# EAGLE design magnet-motor-encoder_v1 (EAGLE 6.6.0)
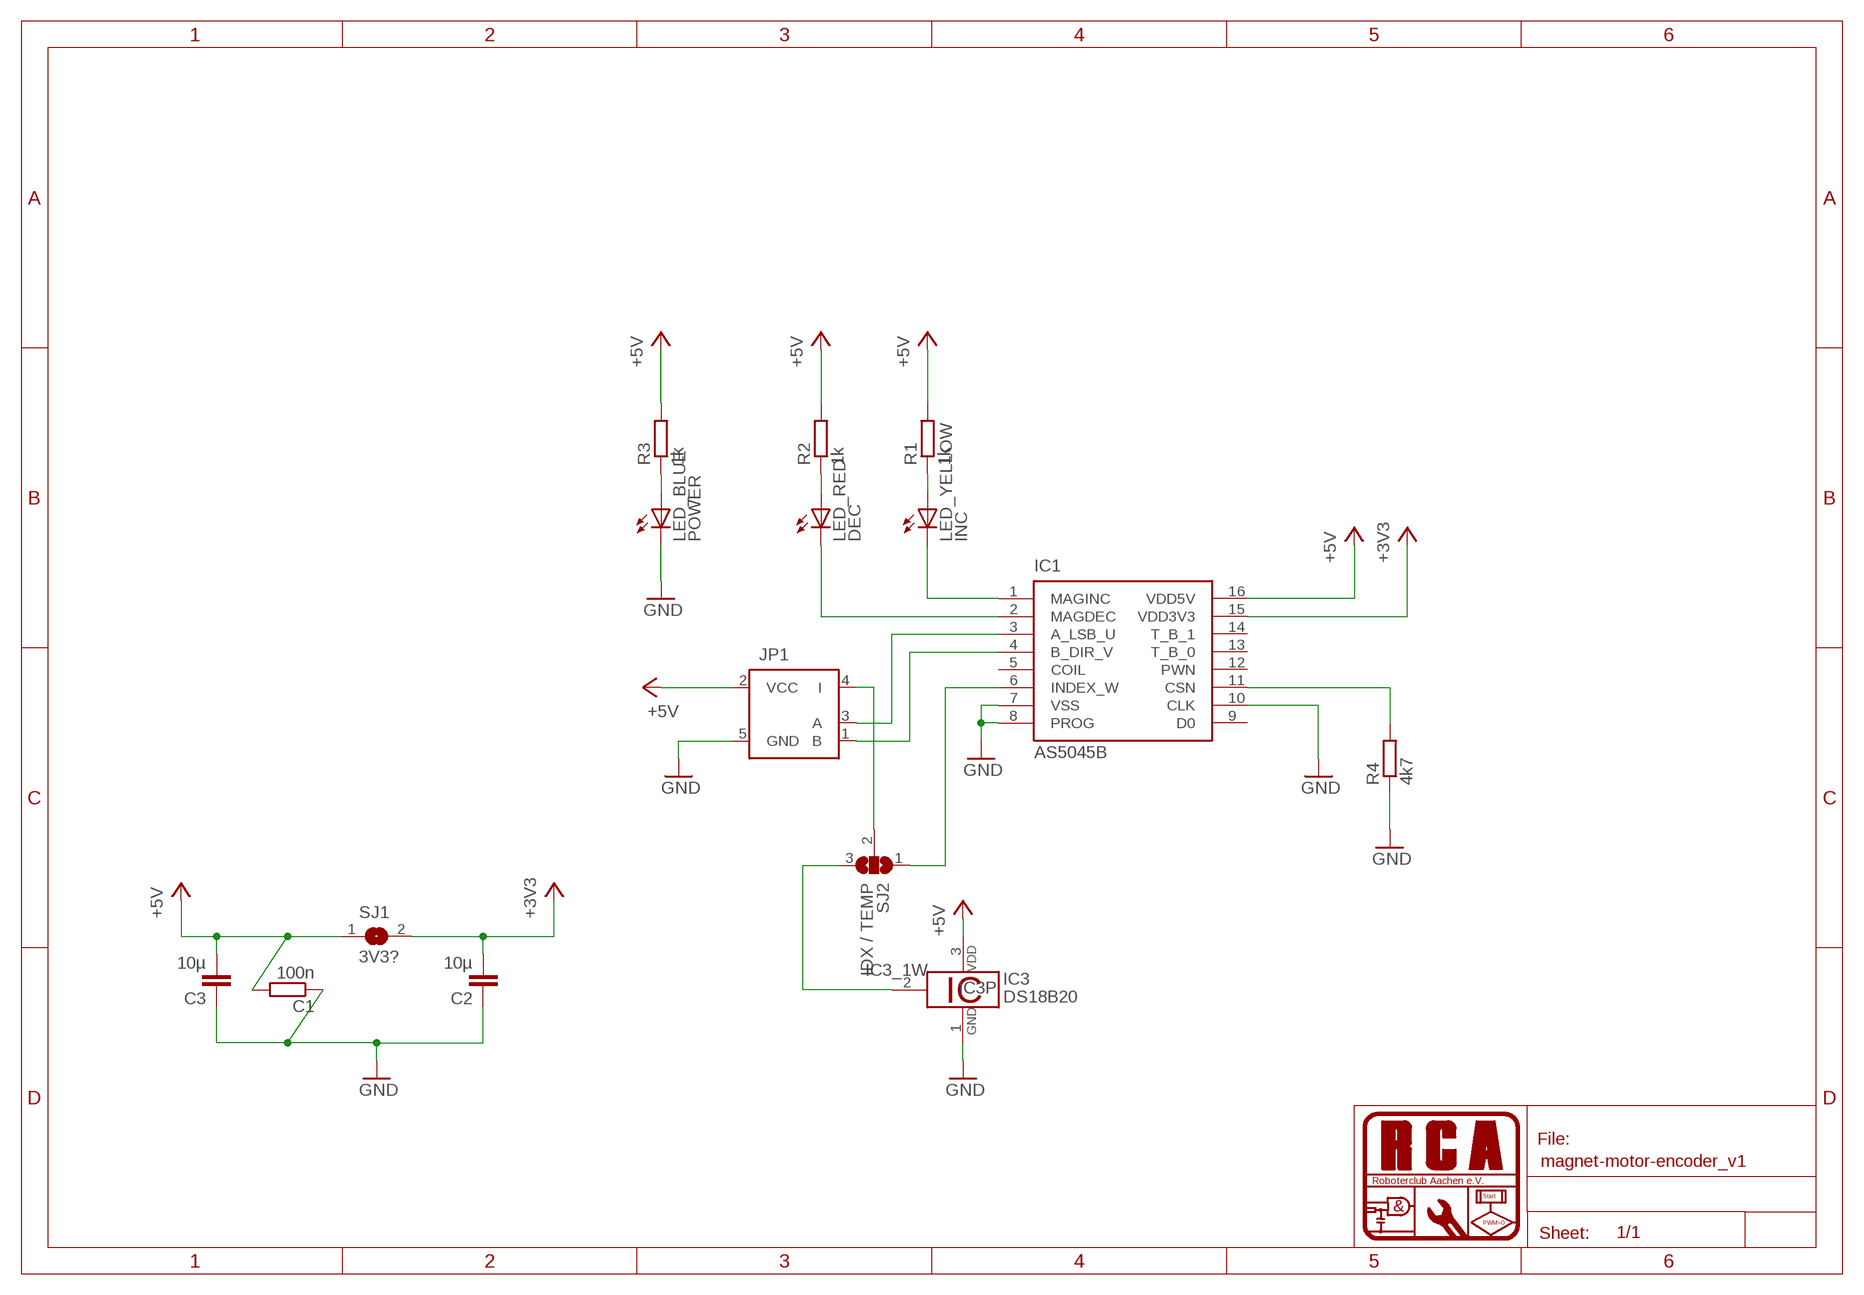
[diagram p0: schematic, sheet 1]

## Parts
C1  100n  R-EU_R0603  [R0603]
C2  10µ  C-EUC0805K  [C0805K]
C3  10µ  C-EUC0805K  [C0805K]
IC1  AS5045B  AS5040  [SSOP16]
IC3  DS18B20  DS18S20  [TO92-]
JP1  ENCODERPSS  [22-23-2051]
LED_BLUE  POWER  LEDCHIPLED_0805  [CHIPLED_0805]
LED_RED  DEC  LEDCHIPLED_0805  [CHIPLED_0805]
LED_YELLOW  INC  LEDCHIPLED_0805  [CHIPLED_0805]
R1  1k  R-EU_R0805  [R0805]
R2  1k  R-EU_R0805  [R0805]
R3  1k  R-EU_R0805  [R0805]
R4  4k7  R-EU_R0805  [R0805]
SJ1  3V3?  SJS  [SJS]
SJ2  IDX / TEMP  SJ2W  [SJ_2]

## Nets
+3V3: C2.2 IC1.15(VDD3V3) SJ1.2
+5V: C1.2 C3.2 IC1.16(VDD5V) IC3.3 JP1.2(VCC) R1.2 R2.2 R3.2 SJ1.1
A: IC1.3(A_LSB_U) JP1.3(A)
B: IC1.4(B_DIR_V) JP1.1(B)
GND: C1.1 C2.1 C3.1 IC1.7(VSS) IC1.8(PROG) IC1.10(CLK) IC3.1 JP1.5(GND) LED_BLUE.C R4.1
LED_RED: IC1.2(MAGDEC) LED_RED.C
LED_YELLOW: IC1.1(MAGINC) LED_YELLOW.C
N$1: JP1.4(I) SJ2.2
N$2: IC1.6(INDEX_W) SJ2.1
N$3: IC3.2 SJ2.3
N$4: IC1.11(CSN) R4.2
R_LED_BLUE: LED_BLUE.A R3.1
R_LED_RED: LED_RED.A R2.1
R_LED_YELLOW: LED_YELLOW.A R1.1
Unconnected: IC1.5(COIL) IC1.9(D0) IC1.12(PWN) IC1.13(T_B_0) IC1.14(T_B_1)

## Library data of the parts
C1 = rcl:R-EU_: RESISTOR, European symbol
C2 C3 = resistor:C-EU: CAPACITOR, European symbol
IC1 = austriamicrosystems:AS5040: 10-BIT PROGRAMMABLE MAGNETIC ROTARY ENCODER Source: www.austriamicrosystems.com .. AS5040DataSheetRev12.pdf; MPN: AS5040ASSU; OC_FARNELL: 1630800; OC_NEWARK: 59P4059
IC3 = 1wire:DS18S20: High Precision Digital Thermometer This chip provides a onewire thermosensor with approx. 0.5°C accuracy.A programmable over/undertemperure alarm is available. Notes: Vdd must be applied for accurate measurements at low temperatures, as the parasite power circuit otherwise heats the sensor. If parasite power is used, Vdd has to be connected to GND. The DS1822 is a low-cost thermometer chip, the DS18B20 is similar to the DS18S20, but with 9..12 Bit programmable precision. Author: Jan Kandziora <jjj@gmx.de>
JP1 = rca_stecker:ENCODER: Encoder Stecker ab 2013: passt direkt auf die Dunkermotoren. vor 2013: Pinout umgedreht
LED_BLUE LED_RED LED_YELLOW = led:LED: LED OSRAM: - CHIPLED LG R971, LG N971, LY N971, LG Q971, LY Q971, LO R971, LY R971 LH N974, LH R974 LS Q976, LO Q976, LY Q976 LO Q996 - Hyper CHIPLED LW Q18S LB Q993, LB Q99A, LB R99A - SideLED LS A670, LO A670, LY A670, LG A670, LP A670 LB A673, LV A673, LT A673, LW A673 LH A674 LY A675 LS A676, LA A676, LO A676, LY A676, LW A676 LS A679, LY A679, LG A679 - Hyper Micro SIDELED® LS Y876, LA Y876, LO Y876, LY Y876 LT Y87S - SmartLED LW L88C, LW L88S LB L89C, LB L89S, LG L890 LS L89K, LO L89K, LY L89K LS L896, LA L896, LO L896, LY L896 - TOPLED LS T670, LO T670, LY T670, LG T670, LP T670 LSG T670, LSP T670, LSY T670, LOP T670, LYG T670 LG T671, LOG T671, LSG T671 LB T673, LV T673, LT T673, LW T673 LH T674 LS T676, LA T676, LO T676, LY T676, LB T676, LH T676, LSB T676, LW T676 LB T67C, LV T67C, LT T67C, LS T67K, LO T67K, LY T67K, LW E67C LS E67B, LA E67B, LO E67B, LY E67B, LB E67C, LV E67C, LT E67C LW T67C LS T679, LY T679, LG T679 LS T770, LO T770, LY T770, LG T770, LP T770 LB T773, LV T773, LT T773, LW T773 LH T774 LS E675, LA E675, LY E675, LS T675 LS T776, LA T776, LO T776, LY T776, LB T776 LHGB T686 LT T68C, LB T68C - Hyper Mini TOPLED® LB M676 - Mini TOPLED Santana® LG M470 LS M47K, LO M47K, LY M47K Source: http://www.osram.convergy.de LUXEON: - LUMILED® LXK2-PW12-R00, LXK2-PW12-S00, LXK2-PW14-U00, LXK2-PW14-V00 LXK2-PM12-R00, LXK2-PM12-S00, LXK2-PM14-U00 LXK2-PE12-Q00, LXK2-PE12-R00, LXK2-PE12-S00, LXK2-PE14-T00, LXK2-PE14-U00 LXK2-PB12-K00, LXK2-PB12-L00, LXK2-PB12-M00, LXK2-PB14-N00, LXK2-PB14-P00, LXK2-PB14-Q00 LXK2-PR12-L00, LXK2-PR12-M00, LXK2-PR14-Q00, LXK2-PR14-R00 LXK2-PD12-Q00, LXK2-PD12-R00, LXK2-PD12-S00 LXK2-PH12-R00, LXK2-PH12-S00 LXK2-PL12-P00, LXK2-PL12-Q00, LXK2-PL12-R00 Source: www.luxeon.com KINGBRIGHT: KA-3528ASYC Source: www.kingbright.com
R1-R4 = resistor:R-EU_: RESISTOR, European symbol
SJ1 = rca_sontiges:SJ: SMD solder JUMPER
SJ2 = jumper:SJ2W: SMD solder JUMPER

## Board
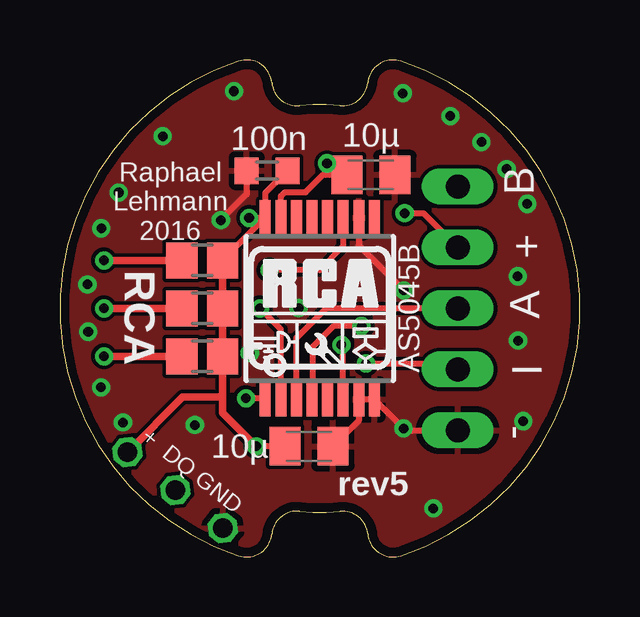
[diagram p1: board, top side]
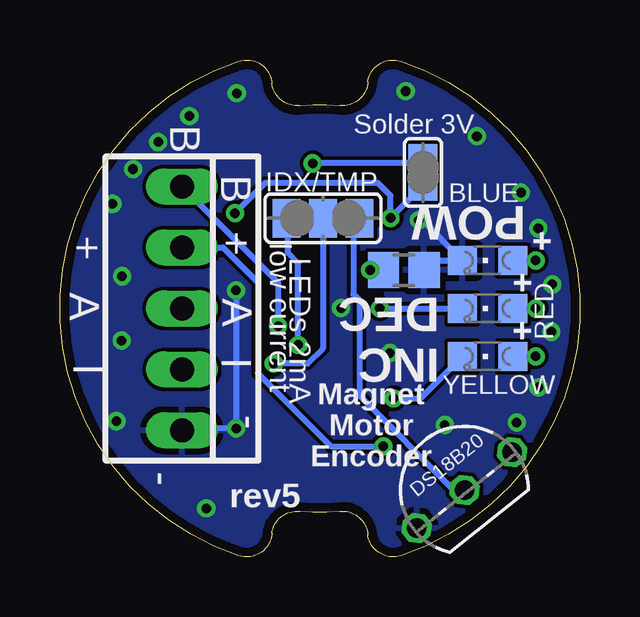
[diagram p2: board, bottom side, seen from below]

Size 21.67 x 20.72 mm. Coordinates in mm from the lower left corner, seen from the top.
Outline: 14.22,0.05 arc144 14.22,20.67 arc102 12.84,19.77 arc-90 11.68,18.82 arc11 10,18.82 arc-90 8.84,19.77 arc102 7.45,20.67 arc144 7.45,0.05 arc102 8.84,0.95 arc-90 10,1.9 arc11 11.68,1.9 arc-90 12.84,0.95 arc102 14.22,0.05
Copper layers (1*16): Top 0.0356mm / dielectric 1.5011mm / Bottom 0.0356mm
Design rules "LaenPCBOrder *": minimum track width 6mil, minimum drill 13mil, track to track 6mil, track to pad 6mil, pad to pad 6mil, via to via 6mil, smd to smd 6mil, copper to edge 15mil, drill to drill 6mil, minimum pad ring 7mil, minimum via ring 7mil, stop-mask expansion 3mil, vias tented up to drill 20mil, thermal gap 10mil

### Footprints (pad centres in the part's own frame; a part is rotated, then mirrored left to right if it is on the bottom)
R0603 = smd 1 x 1.1: 1 -0.85,0; 2 0.85,0
C0805K = smd 1.3 x 1.6: 1 -1,0; 2 1,0
SSOP16 = smd 0.46 x 1.43: 1 -2.275,-3.795; 2 -1.625,-3.795; 3 -0.975,-3.795; 4 -0.325,-3.795; 5 0.325,-3.795; 6 0.975,-3.795; 7 1.625,-3.795; 8 2.275,-3.795; 9 2.275,3.795; 10 1.625,3.795; 11 0.975,3.795; 12 0.325,3.795; 13 -0.325,3.795; 14 -0.975,3.795; 15 -1.625,3.795; 16 -2.275,3.795
TO92- = drill 0.813 octagon: 1 -2.54,0; 2 0,0; 3 2.54,0
22-23-2051 = drill 1 long: 1 -5.08,0; 2 -2.54,0; 3 0,0; 4 2.54,0; 5 5.08,0
CHIPLED_0805 = smd 1.2 x 1.2: A 0,-1.05; C 0,1.05
R0805 = smd 1.3 x 1.5: 1 -0.85,0; 2 0.85,0
SJS = smd 1 x 1.2: 1 -0.683,0; 2 0.683,0
SJ_2 = smd 1.168 x 1.6: 1 -1.524,0; 2 0,0; 3 1.524,0

### Placement (x,y rotation side)
C1  8.64,16.1 0 top
C2  12.97,15.93 180 top
C3  10.39,4.61 180 top
IC1  10.84,10.36 0 top
IC3  4.81,2.78 38.5 bottom
JP1  16.59,10.36 270 bottom
LED_BLUE  3.84,12.36 90 bottom
LED_RED  3.84,10.36 90 bottom
LED_YELLOW  3.84,8.36 90 bottom
R1  5.94,8.36 0 top
R2  5.94,10.36 0 top
R3  5.94,12.36 0 top
R4  7.34,11.96 180 bottom
SJ1  6.54,16.03 90 bottom
SJ2  10.71,14.12 0 bottom
U$1  [LOGO_SILK]  10.84,10.46 0 top

### Tracks (layer width: path | path; a pad name or v marks a point on that pad's centre or on a via)
+3V3  (via drill 0.4)
  Top 0.254: v11.14,16.41 11.49,16.41 C2.2 10.97,15.93 10.25,15.21 9.38,15.21 9.21,15.05 IC1.15
  Bottom 0.254: SJ1.2 6.84,16.41 v11.14,16.41
+5V  (via drill 0.4)
  Top 0.254: 6.77,12.36 IC1.16 | JP1.2 15.16,14.33 v14.38,14.33 | C1.2 8.56,15.18 IC1.16 | IC1.16 8.54,14.13 v7.89,14.13 | C3.2 v8.19,4.61
  Top 0.305: v8.19,4.61 6.79,6.01 6.79,6.66 | 6.79,6.66 R1.2 R2.2 R3.2 | IC3.3 5.12,6.66 6.79,6.66
  Bottom 0.254: JP1.2 14.88,12.9 13.42,11.44 13.42,7.65 10.38,4.61 v8.19,4.61 | SJ1.1 6.67,15.35 v7.89,14.13 7.89,15.06 8.42,15.59 13.12,15.59 v14.38,14.33
A
  Top 0.254: IC1.3 9.86,9.14 11.09,10.36 JP1.3
B  (via drill 0.4)
  Top 0.254: v12.58,9.62 11.41,9.62 10.54,8.75 10.54,6.59 IC1.4
  Bottom 0.254: JP1.1 12.58,11.43 v12.58,9.62
GND  (via drill 0.4)
  Top 0.254: v14.33,5.35 IC1.8 IC1.7 12.46,5.69 C3.1 | v14.33,5.35 14.4,5.28 | 14.4,5.28 14.33,5.21 | IC1.10 12.46,12.99 v14.34,11.11 | v14.33,5.35 14.33,5.21 | 14.33,5.21 14.28,5.17 | 14.4,5.28 JP1.5 | C1.1 7.79,15.12 v6.71,14.04
  Bottom 0.254: v14.34,11.11 v14.34,5.36 | v14.34,5.36 v14.33,5.35 | v14.34,5.36 16.51,5.36 JP1.5 | v6.71,14.04 6.69,14.06 6.59,14.06 LED_BLUE.C 6.09,12.36 R4.1
  other vias: 14.3,19.33 7.26,19.42 19.11,9.02 18.63,16.17 19.32,5.66 5.63,5.5 7.92,8.5 2.45,15.19 4.29,17.54 16.28,18.38 17.58,17.3 19.49,14.72 19.09,11.7 15.57,2.02 1.73,13.7 1.15,11.36 1.18,9.39 1.72,7.07 2.63,5.6 9.95,10.37
  pour Bottom: -1.16,22.36 22.84,22.36 22.84,-1.64 -1.16,-1.64
  pour Top: -1.16,22.36 22.84,22.36 22.84,-1.64 -1.16,-1.64
LED_RED  (via drill 0.4)
  Top 0.254: IC1.2 9.21,9.49 v8.34,10.36
  Bottom 0.254: v8.34,10.36 LED_RED.C
LED_YELLOW  (via drill 0.4)
  Top 0.254: IC1.1 8.56,6.59 8.59,6.61 v7.76,6.61
  Bottom 0.254: v7.76,6.61 6.64,6.61 LED_YELLOW.C
N$1  (via drill 0.4)
  Top 0.254: v12.76,8.06 16.35,8.06 JP1.4
  Bottom 0.254: SJ2.2 10.71,8.7 11.35,8.06 v12.76,8.06
N$2  (via drill 0.4)
  Top 0.254: IC1.6 11.81,8.62 v11.74,8.84
  Bottom 0.254: v11.74,8.84 11.74,12.24 12.17,12.67 12.17,14.06 SJ2.1
N$3
  Bottom 0.254: IC3.2 5.24,2.78 9.18,6.73 9.18,10.71 9.44,10.96 9.44,13.87 SJ2.3
N$4  (via drill 0.4)
  Top 0.254: IC1.11 11.81,12.94 10.84,11.96 v8.74,11.96
  Bottom 0.254: v8.74,11.96 R4.2
R_LED_BLUE  (via drill 0.4)
  Top 0.305: v1.84,12.36 R3.1
  Bottom 0.254: v1.84,12.36 LED_BLUE.A 2.99,12.36
R_LED_RED  (via drill 0.4)
  Top 0.305: v1.84,10.36 R2.1
  Bottom 0.254: LED_RED.A v1.84,10.36
R_LED_YELLOW  (via drill 0.4)
  Top 0.305: v1.84,8.36 R1.1
  Bottom 0.254: LED_YELLOW.A v1.84,8.36

### Text on the board
tNames: B | Raphael / Lehmann / 2016 | RCA | + | A | I | + DQ GND | - | rev5
bNames: Solder 3V | B | B | IDX/TMP | POW | BLUE | low current | + | + | + | LEDs 2mA | RED | + | A | INC / DEC | A | + | I | I | YELLOW | - | Magnet / Motor / Encoder | - | rev5